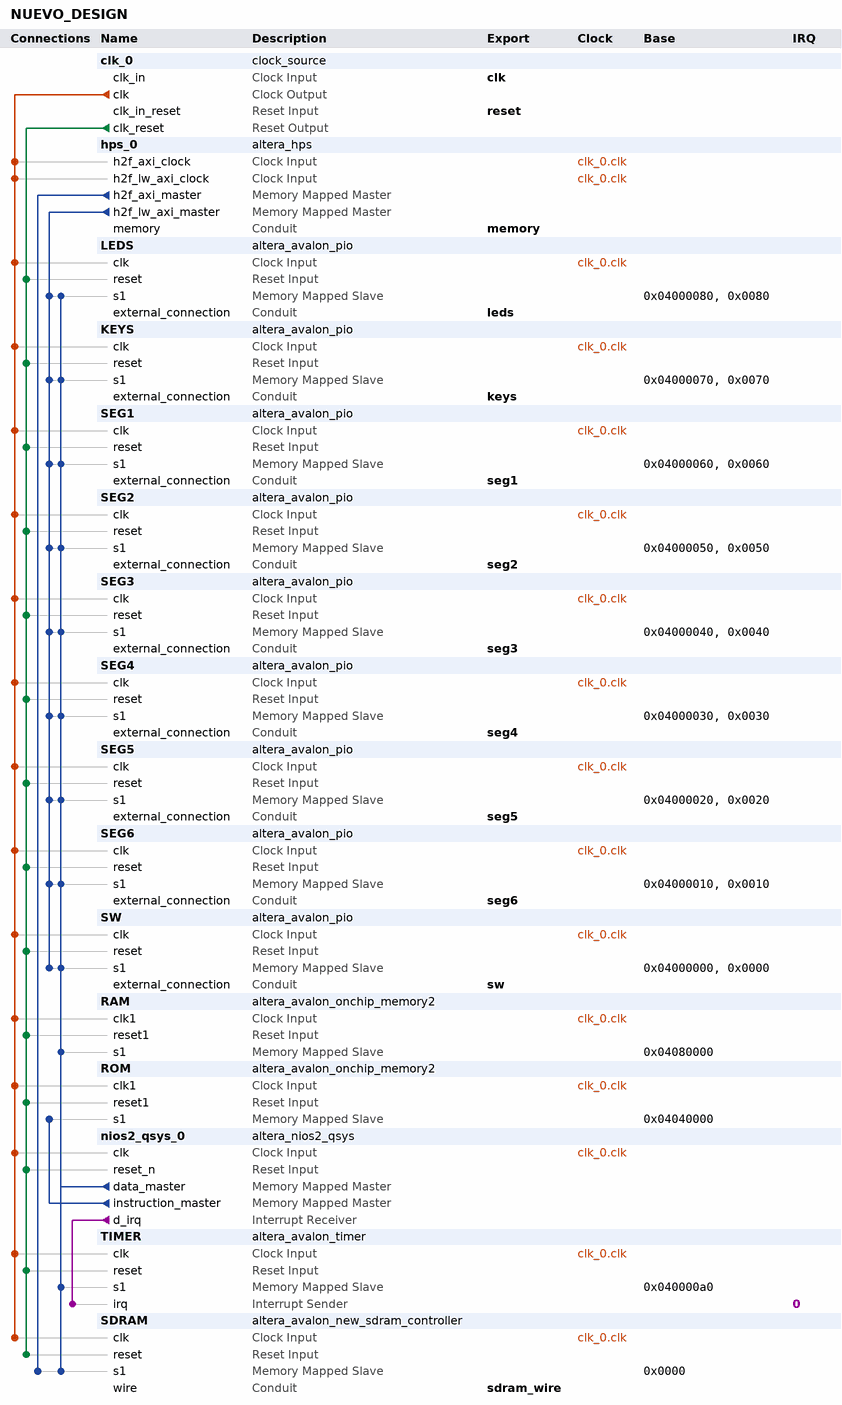
[diagram p0: system contents]
# Platform Designer (Qsys) system NUEVO_DESIGN, Cyclone V 5CSEMA5F31C6
# Parameters at their usual value, and those the tool derives, are not listed.
package require -exact qsys 18.1
create_system NUEVO_DESIGN
set_project_property DEVICE_FAMILY {Cyclone V}
set_project_property DEVICE 5CSEMA5F31C6

add_instance clk_0 clock_source 18.1
set_instance_parameter_value clk_0 clockFrequency 50000000

add_instance hps_0 altera_hps 18.1
set_instance_parameter_value hps_0 EMAC1_Mode N/A
set_instance_parameter_value hps_0 EMAC1_PinMuxing Unused
set_instance_parameter_value hps_0 F2SCLK_COLDRST_Enable false
set_instance_parameter_value hps_0 F2SCLK_DBGRST_Enable false
set_instance_parameter_value hps_0 F2SCLK_WARMRST_Enable false
set_instance_parameter_value hps_0 F2SINTERRUPT_Enable false
set_instance_parameter_value hps_0 F2S_Width 0
set_instance_parameter_value hps_0 FPGA_PERIPHERAL_OUTPUT_CLOCK_FREQ_EMAC0_GTX_CLK 125
set_instance_parameter_value hps_0 FPGA_PERIPHERAL_OUTPUT_CLOCK_FREQ_EMAC0_MD_CLK 2.5
set_instance_parameter_value hps_0 FPGA_PERIPHERAL_OUTPUT_CLOCK_FREQ_EMAC1_GTX_CLK 125
set_instance_parameter_value hps_0 FPGA_PERIPHERAL_OUTPUT_CLOCK_FREQ_EMAC1_MD_CLK 2.5
set_instance_parameter_value hps_0 HPS_PROTOCOL DDR3
set_instance_parameter_value hps_0 I2C0_Mode N/A
set_instance_parameter_value hps_0 I2C0_PinMuxing Unused
set_instance_parameter_value hps_0 I2C1_Mode N/A
set_instance_parameter_value hps_0 I2C1_PinMuxing Unused
set_instance_parameter_value hps_0 LWH2F_Enable true
set_instance_parameter_value hps_0 MEM_BANKADDR_WIDTH 3
set_instance_parameter_value hps_0 MEM_CLK_FREQ 300.0
set_instance_parameter_value hps_0 MEM_CLK_FREQ_MAX 400.0
set_instance_parameter_value hps_0 MEM_COL_ADDR_WIDTH 8
set_instance_parameter_value hps_0 MEM_DQ_WIDTH 8
set_instance_parameter_value hps_0 MEM_DRV_STR RZQ/6
set_instance_parameter_value hps_0 MEM_ROW_ADDR_WIDTH 12
set_instance_parameter_value hps_0 MEM_RTT_NOM {ODT Disabled}
set_instance_parameter_value hps_0 MEM_RTT_WR {Dynamic ODT off}
set_instance_parameter_value hps_0 MEM_TCL 7
set_instance_parameter_value hps_0 MEM_TFAW_NS 37.5
set_instance_parameter_value hps_0 MEM_TINIT_US 499
set_instance_parameter_value hps_0 MEM_TMRD_CK 3
set_instance_parameter_value hps_0 MEM_TRAS_NS 40.0
set_instance_parameter_value hps_0 MEM_TRCD_NS 15.0
set_instance_parameter_value hps_0 MEM_TREFI_US 7.0
set_instance_parameter_value hps_0 MEM_TRFC_NS 75.0
set_instance_parameter_value hps_0 MEM_TRP_NS 15.0
set_instance_parameter_value hps_0 MEM_TWTR 2
set_instance_parameter_value hps_0 MEM_VENDOR JEDEC
set_instance_parameter_value hps_0 MEM_WTCL 6
set_instance_parameter_value hps_0 QSPI_Mode N/A
set_instance_parameter_value hps_0 QSPI_PinMuxing Unused
set_instance_parameter_value hps_0 REF_CLK_FREQ 125.0
set_instance_parameter_value hps_0 S2FCLK_USER2CLK 5
set_instance_parameter_value hps_0 S2F_Width 2
set_instance_parameter_value hps_0 SDIO_Mode N/A
set_instance_parameter_value hps_0 SDIO_PinMuxing Unused
set_instance_parameter_value hps_0 SPIM1_Mode N/A
set_instance_parameter_value hps_0 SPIM1_PinMuxing Unused
set_instance_parameter_value hps_0 STM_Enable false
set_instance_parameter_value hps_0 TIMING_BOARD_AC_SKEW 0.02
set_instance_parameter_value hps_0 TIMING_BOARD_AC_TO_CK_SKEW 0.0
set_instance_parameter_value hps_0 TIMING_BOARD_DQ_TO_DQS_SKEW 0.0
set_instance_parameter_value hps_0 TIMING_BOARD_MAX_CK_DELAY 0.6
set_instance_parameter_value hps_0 TIMING_BOARD_MAX_DQS_DELAY 0.6
set_instance_parameter_value hps_0 TIMING_BOARD_SKEW_BETWEEN_DQS 0.02
set_instance_parameter_value hps_0 TIMING_BOARD_SKEW_CKDQS_DIMM_MAX 0.01
set_instance_parameter_value hps_0 TIMING_BOARD_SKEW_CKDQS_DIMM_MIN -0.01
set_instance_parameter_value hps_0 TIMING_BOARD_SKEW_WITHIN_DQS 0.02
set_instance_parameter_value hps_0 TIMING_TDH 125
set_instance_parameter_value hps_0 TIMING_TDQSCK 400
set_instance_parameter_value hps_0 TIMING_TDQSQ 120
set_instance_parameter_value hps_0 TIMING_TDS 50
set_instance_parameter_value hps_0 TIMING_TIH 250
set_instance_parameter_value hps_0 TIMING_TIS 175
set_instance_parameter_value hps_0 TIMING_TQSH 0.38
set_instance_parameter_value hps_0 UART0_Mode N/A
set_instance_parameter_value hps_0 UART0_PinMuxing Unused
set_instance_parameter_value hps_0 USB1_Mode N/A
set_instance_parameter_value hps_0 USB1_PinMuxing Unused
set_instance_parameter_value hps_0 desired_cfg_clk_mhz 100.0
set_instance_parameter_value hps_0 desired_qspi_clk_mhz 400.0

add_instance LEDS altera_avalon_pio 18.1
set_instance_parameter_value LEDS direction Output
set_instance_parameter_value LEDS width 10

add_instance KEYS altera_avalon_pio 18.1
set_instance_parameter_value KEYS direction Input
set_instance_parameter_value KEYS width 4

add_instance SEG1 altera_avalon_pio 18.1
set_instance_parameter_value SEG1 direction Output
set_instance_parameter_value SEG1 width 7

add_instance SEG2 altera_avalon_pio 18.1
set_instance_parameter_value SEG2 direction Output
set_instance_parameter_value SEG2 width 7

add_instance SEG3 altera_avalon_pio 18.1
set_instance_parameter_value SEG3 direction Output
set_instance_parameter_value SEG3 width 7

add_instance SEG4 altera_avalon_pio 18.1
set_instance_parameter_value SEG4 direction Output
set_instance_parameter_value SEG4 width 7

add_instance SEG5 altera_avalon_pio 18.1
set_instance_parameter_value SEG5 direction Output
set_instance_parameter_value SEG5 width 7

add_instance SEG6 altera_avalon_pio 18.1
set_instance_parameter_value SEG6 direction Output
set_instance_parameter_value SEG6 width 7

add_instance SW altera_avalon_pio 18.1
set_instance_parameter_value SW direction Input
set_instance_parameter_value SW width 10

add_instance RAM altera_avalon_onchip_memory2 18.1
set_instance_parameter_value RAM dataWidth 32
set_instance_parameter_value RAM dualPort false
set_instance_parameter_value RAM initMemContent true
set_instance_parameter_value RAM initializationFileName onchip_mem.hex
set_instance_parameter_value RAM memorySize 160000

add_instance ROM altera_avalon_onchip_memory2 18.1
set_instance_parameter_value ROM dataWidth 32
set_instance_parameter_value ROM dualPort false
set_instance_parameter_value ROM initMemContent true
set_instance_parameter_value ROM initializationFileName onchip_mem.hex
set_instance_parameter_value ROM memorySize 160000
set_instance_parameter_value ROM writable false

add_instance nios2_qsys_0 altera_nios2_qsys 16.1
set_instance_parameter_value nios2_qsys_0 breakSlave ROM.s1
set_instance_parameter_value nios2_qsys_0 debug_level NoDebug
set_instance_parameter_value nios2_qsys_0 exceptionSlave ROM.s1
set_instance_parameter_value nios2_qsys_0 icache_size 4096
set_instance_parameter_value nios2_qsys_0 impl Small
set_instance_parameter_value nios2_qsys_0 mmu_TLBMissExcSlave None
set_instance_parameter_value nios2_qsys_0 resetSlave ROM.s1
set_instance_parameter_value nios2_qsys_0 resetrequest_enabled true

add_instance TIMER altera_avalon_timer 18.1
set_instance_parameter_value TIMER period 1
set_instance_parameter_value TIMER periodUnits MSEC

add_instance SDRAM altera_avalon_new_sdram_controller 18.1
set_instance_parameter_value SDRAM TAC 5.4
set_instance_parameter_value SDRAM TRCD 15.0
set_instance_parameter_value SDRAM TRP 15.0
set_instance_parameter_value SDRAM casLatency 3
set_instance_parameter_value SDRAM columnWidth 10
set_instance_parameter_value SDRAM dataWidth 16
set_instance_parameter_value SDRAM generateSimulationModel false
set_instance_parameter_value SDRAM model single_Micron_MT48LC4M32B2_7_chip
set_instance_parameter_value SDRAM numberOfBanks 4
set_instance_parameter_value SDRAM numberOfChipSelects 1
set_instance_parameter_value SDRAM powerUpDelay 100.0
set_instance_parameter_value SDRAM refreshPeriod 7.8125
set_instance_parameter_value SDRAM rowWidth 13

# connections
add_connection clk_0.clk hps_0.h2f_axi_clock clock
add_connection clk_0.clk hps_0.h2f_lw_axi_clock clock
add_connection clk_0.clk KEYS.clk clock
add_connection clk_0.clk LEDS.clk clock
add_connection clk_0.clk nios2_qsys_0.clk clock
add_connection clk_0.clk RAM.clk1 clock
add_connection clk_0.clk ROM.clk1 clock
add_connection clk_0.clk SDRAM.clk clock
add_connection clk_0.clk SEG1.clk clock
add_connection clk_0.clk SEG2.clk clock
add_connection clk_0.clk SEG3.clk clock
add_connection clk_0.clk SEG4.clk clock
add_connection clk_0.clk SEG5.clk clock
add_connection clk_0.clk SEG6.clk clock
add_connection clk_0.clk SW.clk clock
add_connection clk_0.clk TIMER.clk clock
add_connection clk_0.clk_reset KEYS.reset reset
add_connection clk_0.clk_reset LEDS.reset reset
add_connection clk_0.clk_reset nios2_qsys_0.reset_n reset
add_connection clk_0.clk_reset RAM.reset1 reset
add_connection clk_0.clk_reset ROM.reset1 reset
add_connection clk_0.clk_reset SDRAM.reset reset
add_connection clk_0.clk_reset SEG1.reset reset
add_connection clk_0.clk_reset SEG2.reset reset
add_connection clk_0.clk_reset SEG3.reset reset
add_connection clk_0.clk_reset SEG4.reset reset
add_connection clk_0.clk_reset SEG5.reset reset
add_connection clk_0.clk_reset SEG6.reset reset
add_connection clk_0.clk_reset SW.reset reset
add_connection clk_0.clk_reset TIMER.reset reset
add_connection hps_0.h2f_axi_master SDRAM.s1 avalon
set_connection_parameter_value hps_0.h2f_axi_master/SDRAM.s1 baseAddress 0x0000
add_connection hps_0.h2f_lw_axi_master KEYS.s1 avalon
set_connection_parameter_value hps_0.h2f_lw_axi_master/KEYS.s1 baseAddress 0x0070
add_connection hps_0.h2f_lw_axi_master LEDS.s1 avalon
set_connection_parameter_value hps_0.h2f_lw_axi_master/LEDS.s1 baseAddress 0x0080
add_connection hps_0.h2f_lw_axi_master SEG1.s1 avalon
set_connection_parameter_value hps_0.h2f_lw_axi_master/SEG1.s1 baseAddress 0x0060
add_connection hps_0.h2f_lw_axi_master SEG2.s1 avalon
set_connection_parameter_value hps_0.h2f_lw_axi_master/SEG2.s1 baseAddress 0x0050
add_connection hps_0.h2f_lw_axi_master SEG3.s1 avalon
set_connection_parameter_value hps_0.h2f_lw_axi_master/SEG3.s1 baseAddress 0x0040
add_connection hps_0.h2f_lw_axi_master SEG4.s1 avalon
set_connection_parameter_value hps_0.h2f_lw_axi_master/SEG4.s1 baseAddress 0x0030
add_connection hps_0.h2f_lw_axi_master SEG5.s1 avalon
set_connection_parameter_value hps_0.h2f_lw_axi_master/SEG5.s1 baseAddress 0x0020
add_connection hps_0.h2f_lw_axi_master SEG6.s1 avalon
set_connection_parameter_value hps_0.h2f_lw_axi_master/SEG6.s1 baseAddress 0x0010
add_connection hps_0.h2f_lw_axi_master SW.s1 avalon
set_connection_parameter_value hps_0.h2f_lw_axi_master/SW.s1 baseAddress 0x0000
add_connection nios2_qsys_0.data_master KEYS.s1 avalon
set_connection_parameter_value nios2_qsys_0.data_master/KEYS.s1 baseAddress 0x04000070
add_connection nios2_qsys_0.data_master LEDS.s1 avalon
set_connection_parameter_value nios2_qsys_0.data_master/LEDS.s1 baseAddress 0x04000080
add_connection nios2_qsys_0.data_master RAM.s1 avalon
set_connection_parameter_value nios2_qsys_0.data_master/RAM.s1 baseAddress 0x04080000
add_connection nios2_qsys_0.data_master SDRAM.s1 avalon
set_connection_parameter_value nios2_qsys_0.data_master/SDRAM.s1 baseAddress 0x0000
add_connection nios2_qsys_0.data_master SEG1.s1 avalon
set_connection_parameter_value nios2_qsys_0.data_master/SEG1.s1 baseAddress 0x04000060
add_connection nios2_qsys_0.data_master SEG2.s1 avalon
set_connection_parameter_value nios2_qsys_0.data_master/SEG2.s1 baseAddress 0x04000050
add_connection nios2_qsys_0.data_master SEG3.s1 avalon
set_connection_parameter_value nios2_qsys_0.data_master/SEG3.s1 baseAddress 0x04000040
add_connection nios2_qsys_0.data_master SEG4.s1 avalon
set_connection_parameter_value nios2_qsys_0.data_master/SEG4.s1 baseAddress 0x04000030
add_connection nios2_qsys_0.data_master SEG5.s1 avalon
set_connection_parameter_value nios2_qsys_0.data_master/SEG5.s1 baseAddress 0x04000020
add_connection nios2_qsys_0.data_master SEG6.s1 avalon
set_connection_parameter_value nios2_qsys_0.data_master/SEG6.s1 baseAddress 0x04000010
add_connection nios2_qsys_0.data_master SW.s1 avalon
set_connection_parameter_value nios2_qsys_0.data_master/SW.s1 baseAddress 0x04000000
add_connection nios2_qsys_0.data_master TIMER.s1 avalon
set_connection_parameter_value nios2_qsys_0.data_master/TIMER.s1 baseAddress 0x040000a0
add_connection nios2_qsys_0.instruction_master ROM.s1 avalon
set_connection_parameter_value nios2_qsys_0.instruction_master/ROM.s1 baseAddress 0x04040000
add_connection nios2_qsys_0.d_irq TIMER.irq interrupt
set_connection_parameter_value nios2_qsys_0.d_irq/TIMER.irq irqNumber 0

# exported interfaces
add_interface clk clock sink
set_interface_property clk EXPORT_OF clk_0.clk_in
add_interface keys conduit end
set_interface_property keys EXPORT_OF KEYS.external_connection
add_interface leds conduit end
set_interface_property leds EXPORT_OF LEDS.external_connection
add_interface memory conduit end
set_interface_property memory EXPORT_OF hps_0.memory
add_interface reset reset sink
set_interface_property reset EXPORT_OF clk_0.clk_in_reset
add_interface sdram_wire conduit end
set_interface_property sdram_wire EXPORT_OF SDRAM.wire
add_interface seg1 conduit end
set_interface_property seg1 EXPORT_OF SEG1.external_connection
add_interface seg2 conduit end
set_interface_property seg2 EXPORT_OF SEG2.external_connection
add_interface seg3 conduit end
set_interface_property seg3 EXPORT_OF SEG3.external_connection
add_interface seg4 conduit end
set_interface_property seg4 EXPORT_OF SEG4.external_connection
add_interface seg5 conduit end
set_interface_property seg5 EXPORT_OF SEG5.external_connection
add_interface seg6 conduit end
set_interface_property seg6 EXPORT_OF SEG6.external_connection
add_interface sw conduit end
set_interface_property sw EXPORT_OF SW.external_connection

set_interconnect_requirement {$system} qsys_mm.clockCrossingAdapter HANDSHAKE
set_interconnect_requirement {$system} qsys_mm.enableEccProtection FALSE
set_interconnect_requirement {$system} qsys_mm.insertDefaultSlave FALSE
set_interconnect_requirement {$system} qsys_mm.maxAdditionalLatency 1

save_system NUEVO_DESIGN.qsys
